# Altium schematic sheet sensors-digital.SchDoc
size A4
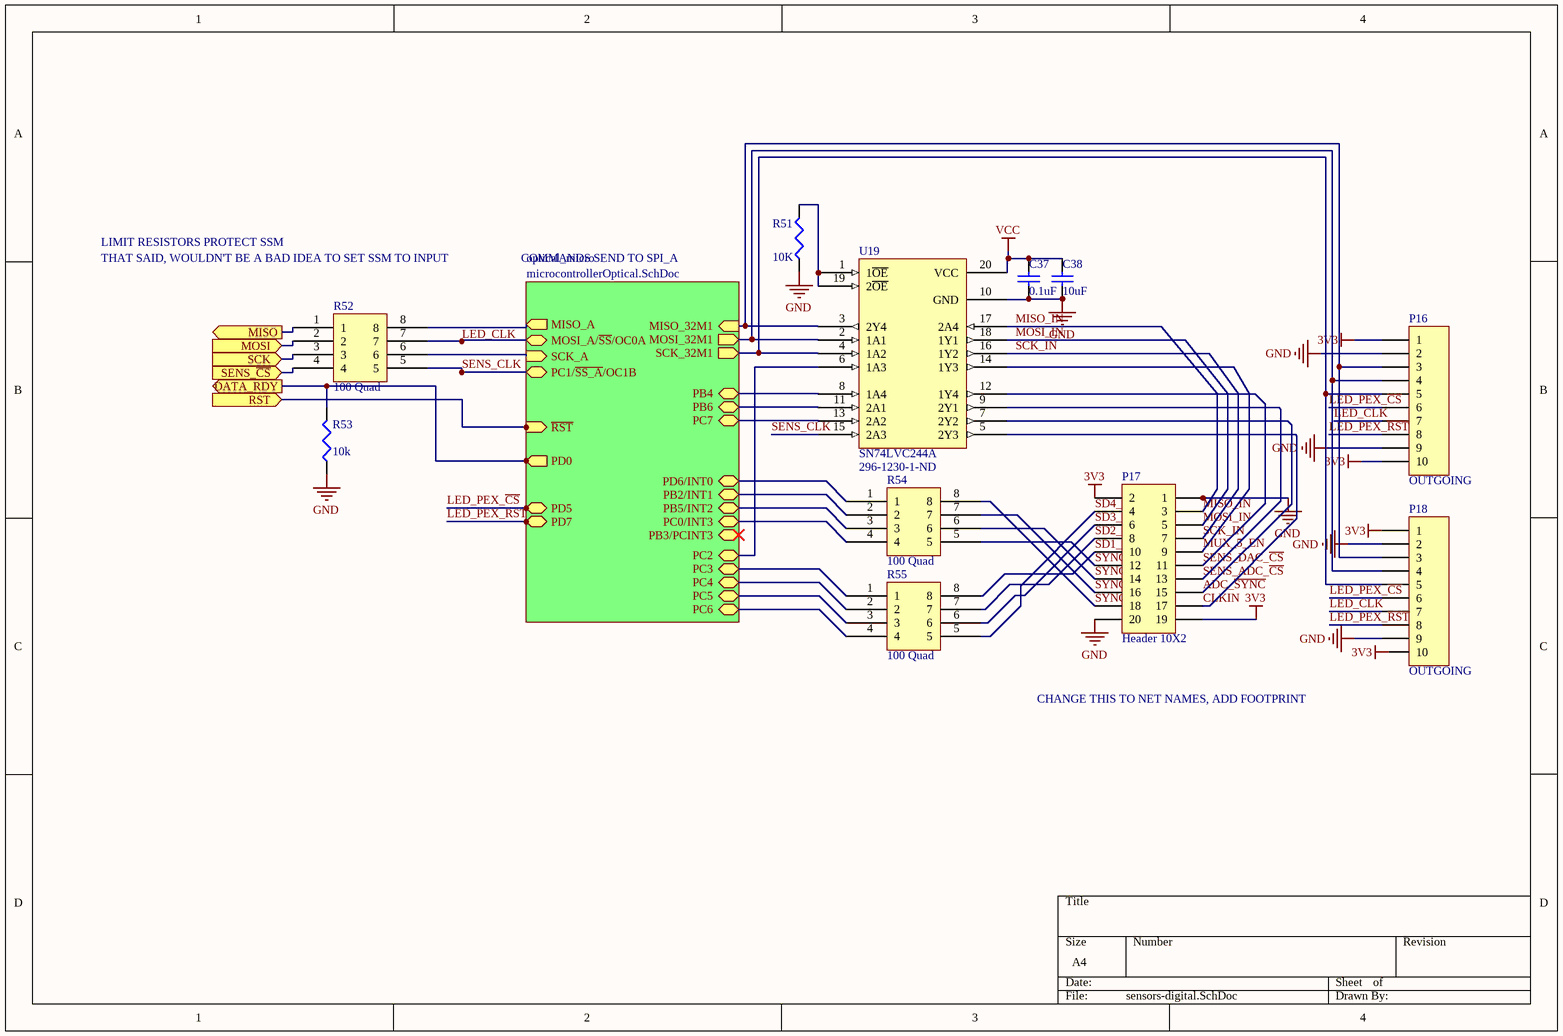
[diagram p0: sensors-digital.SchDoc]

## Parts
C37  0.1uF  [1608[0603]]
C38  10uF  [1608[0603]]
P16  OUTGOING  [DF14-10P-1.25H(55)]
P17  Header 10X2  [CON20_2X10_Female]
P18  OUTGOING  [DF14-10P-1.25H(55)]
R51  10K  [J1-0603]
R52  100 Quad  [ResQuad-320X150]
R53  10k  [J1-0603]
R54  100 Quad  [ResQuad-320X150]
R55  100 Quad  [ResQuad-320X150]
U19  SN74LVC244A  Supplier Part Number 1: 296-1230-1-ND  [SOP65P650X440-20N]

## Sub-sheets
optical_micro = microcontrollerOptical.SchDoc: PB5/INT2 (bidir), MOSI_32M1 (out), PC2 (bidir), PC3 (bidir), SCK_32M1 (out), PD7 (bidir), PB4 (bidir), PB6 (bidir), PC0/INT3 (bidir), MISO_A (out), PB3/PCINT3 (bidir), MISO_32M1 (in), PC6 (bidir), PC4 (bidir), PC1/~{SS_A}/OC1B (bidir), PC7 (bidir), PD5 (bidir), PB2/INT1 (bidir), SCK_A (in), PD0 (out), ~{RST} (in), MOSI_A/~{SS}/OC0A (bidir), PD6/INT0 (bidir), PC5 (bidir)

## Ports
DATA_RDY (out), MISO (out), MOSI (in), RST (in), SCK (in), SENS_~{CS} (in)

## Nets
3V3: P16.1 P16.10 P17.2 P17.19 P18.1
GND: C37.1 C38.1 P16.2 P16.9 P17.1 P17.20 P18.2 P18.9 R51.1 R53.1 U19.10(GND)
VCC: C37.2 C38.2 U19.20(VCC)
ADC_~{SYNC}: P17.15 U19.7(2Y2)
CLKIN: P17.17 U19.5(2Y3)
DATA_RDY: R53.2 ; port DATA_RDY, sheet optical_micro/PD0
LED_CLK: P16.7 P18.7 R52.7 ; sheet optical_micro/MOSI_A/~{SS}/OC0A
LED_PEX_~{CS}: P16.6 P18.6 ; sheet optical_micro/PD5
LED_PEX_~{RST}: P16.8 P18.8 ; sheet optical_micro/PD7
MISO: R52.1 ; port MISO
MISO_IN: P17.3 U19.17(2A4)
MOSI: R52.2 ; port MOSI
MOSI_IN: P17.5 U19.18(1Y1)
MUX_5_EN: P17.9 U19.14(1Y3)
RST: port RST, sheet optical_micro/~{RST}
SCK: R52.3 ; port SCK
SCK_IN: P17.7 U19.16(1Y2)
SD1_~{CS}: P17.10 R55.8
SD2_~{CS}: P17.8 R55.7
SD3_~{CS}: P17.6 R55.6
SD4_~{CS}: P17.4 R55.5
SENS_ADC_~{CS}: P17.13 U19.9(2Y1)
SENS_~{CS}: R52.4 ; port SENS_~{CS}
SENS_CLK: R52.5 U19.15(2A3) ; sheet optical_micro/PC1/~{SS_A}/OC1B
SENS_DAC_~{CS}: P17.11 U19.12(1Y4)
SYNCO1: P17.18 R54.8
SYNCO2: P17.16 R54.7
SYNCO3: P17.14 R54.6
SYNCO4: P17.12 R54.5
NetP16_3: P16.3 P18.3 U19.3(2Y4) ; sheet optical_micro/MISO_32M1
NetP16_4: P16.4 P18.4 U19.2(1A1) ; sheet optical_micro/MOSI_32M1
NetP16_5: P16.5 P18.5 U19.4(1A2) ; sheet optical_micro/SCK_32M1
NetR51_2: R51.2 U19.1(1~{OE}) U19.19(2~{OE})
NetR52_6: R52.6 ; sheet optical_micro/SCK_A
NetR52_8: R52.8 ; sheet optical_micro/MISO_A
NetR54_1: R54.1 ; sheet optical_micro/PD6/INT0
NetR54_2: R54.2 ; sheet optical_micro/PB2/INT1
NetR54_3: R54.3 ; sheet optical_micro/PB5/INT2
NetR54_4: R54.4 ; sheet optical_micro/PC0/INT3
NetR55_1: R55.1 ; sheet optical_micro/PC3
NetR55_2: R55.2 ; sheet optical_micro/PC4
NetR55_3: R55.3 ; sheet optical_micro/PC5
NetR55_4: R55.4 ; sheet optical_micro/PC6
NetU19_6: U19.6(1A3) ; sheet optical_micro/PC2
NetU19_8: U19.8(1A4) ; sheet optical_micro/PB4
NetU19_11: U19.11(2A1) ; sheet optical_micro/PB6
NetU19_13: U19.13(2A2) ; sheet optical_micro/PC7

Not connected (* = marked no-connect by the designer): P18 10

## Notes on the sheet
- LIMIT RESISTORS PROTECT SSM
- THAT SAID, WOULDN'T BE A BAD IDEA TO SET SSM TO INPUT
- COMMANDS SEND TO SPI_A
- CHANGE THIS TO NET NAMES, ADD FOOTPRINT
- Labels drawn without touching a wire or pin: 3V3

## Library data of the parts
C37 C38 = Cap Semi: Capacitor (Semiconductor SIM Model); Published: 8-Jun-2000; LatestRevisionDate: 29-May-2009; LatestRevisionNote: IPC-7351 Footprint Added.; PackageReference: C1206; Publisher: Altium Limited; PackageDescription: Chip Capacitor; Supplier: Digi-Key
  C37: Value: 0.1uF
  C38: Value: 10uF
P16 P18 = Header 10: Header, 10-Pin; LatestRevisionDate: 17-Jul-2002; LatestRevisionNote: Re-released for DXP Platform.; Publisher: Altium Limited; Supplier: Digi-Key
P17 = Header 10X2: Header, 10-Pin, Dual row; LatestRevisionDate: 17-Jul-2002; LatestRevisionNote: Re-released for DXP Platform.; Publisher: Altium Limited
R51 R53 = Res3: Resistor; Published: 8-Jun-2000; LatestRevisionDate: 29-May-2009; LatestRevisionNote: IPC-7351 Footprint Added.; PackageReference: J1-0603; Publisher: Altium Limited; PackageDescription: Chip Resistor; Supplier: Digi-Key
  R51: Value: 10K
  R53: Value: 10k
R52 R54 R55 = Res Quad Pack: Quad pack resistor; Value: 100 Quad; Supplier: Digi-Key; Supplier Part Number: Y4101CT-ND
U19 = SN74LVC244A: Octal buffer or driver with 3-state outputs.; Supplier 1: Digi-Key; Supplier: Digi-Key